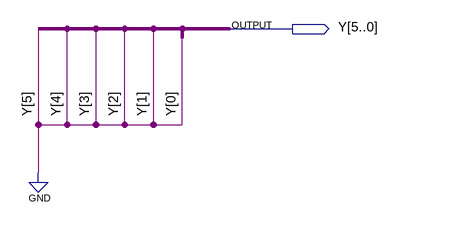
[diagram p0: schematic sheet]
// Quartus schematic Const_0_5bit.bdf as structural Verilog: 0 symbols, 1 pins
module Const_0_5bit (
  output [5:0] Y
);


  assign Y = {6{1'b0}};
endmodule
